# Altium schematic sheet AIR_QUALITY.SchDoc
size A4; SheetNumber: 1; SheetTotal: 4
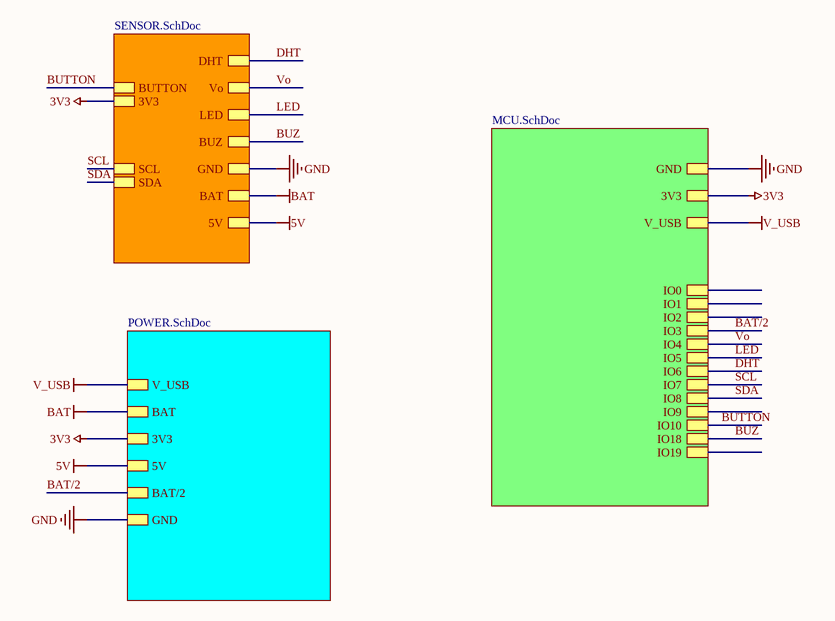
[diagram p0: AIR_QUALITY.SchDoc]

## Sub-sheets
Designator = SENSOR.SchDoc: DHT, Vo, LED, BUZ, GND, BAT, 5V, SCL, SDA, BUTTON, 3V3
Designator = POWER.SchDoc: 5V, BAT/2, BAT, 3V3, GND, V_USB
MCU.SchDoc = MCU.SchDoc: GND, 3V3, V_USB, IO0, IO1, IO2, IO3, IO4, IO5, IO6, IO7, IO8, IO9, IO10, IO18, IO19

## Nets
3V3: sheet Designator/3V3, sheet Designator/3V3, sheet MCU.SchDoc/3V3
5V: sheet Designator/5V, sheet Designator/5V
BAT: sheet Designator/BAT, sheet Designator/BAT
GND: sheet Designator/GND, sheet Designator/GND, sheet MCU.SchDoc/GND
V_USB: sheet Designator/V_USB, sheet MCU.SchDoc/V_USB
BAT/2: sheet Designator/BAT/2, sheet MCU.SchDoc/IO3
BUTTON: sheet Designator/BUTTON, sheet MCU.SchDoc/IO10
BUZ: sheet Designator/BUZ, sheet MCU.SchDoc/IO18
DHT: sheet Designator/DHT, sheet MCU.SchDoc/IO6
LED: sheet Designator/LED, sheet MCU.SchDoc/IO5
SCL: sheet Designator/SCL, sheet MCU.SchDoc/IO7
SDA: sheet Designator/SDA, sheet MCU.SchDoc/IO8
Vo: sheet Designator/Vo, sheet MCU.SchDoc/IO4